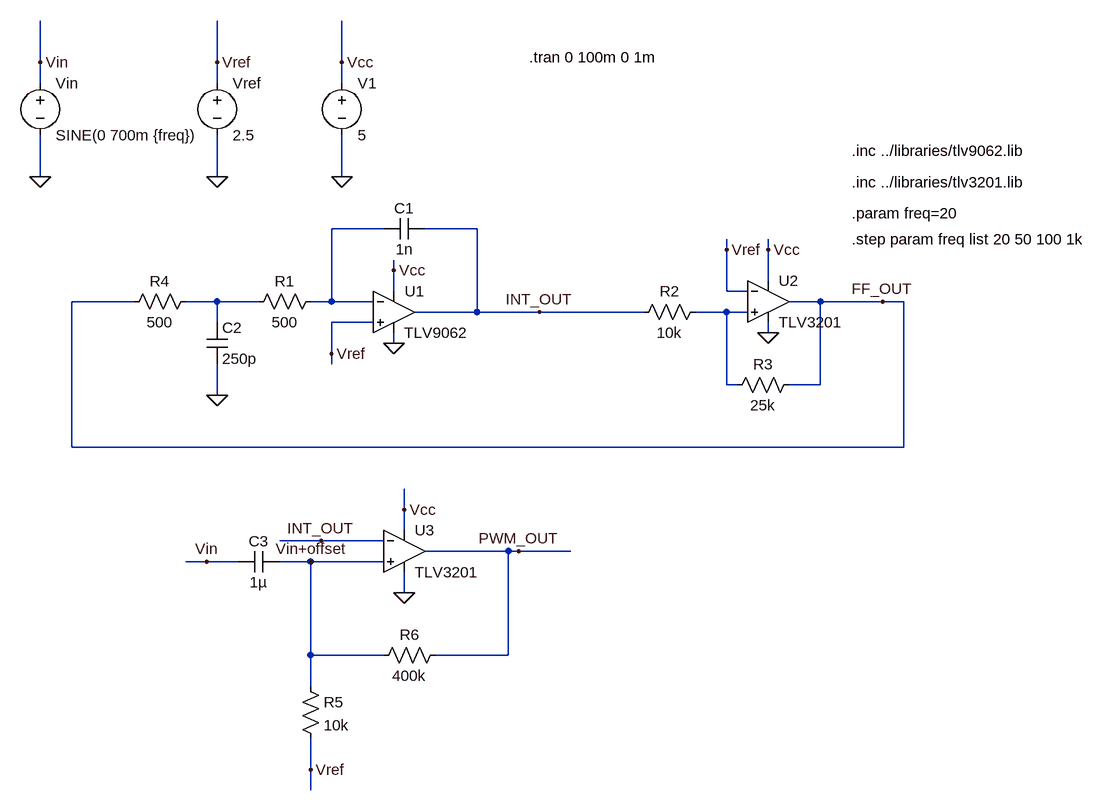
[diagram p0: schematic PWM_modulator.asc]
PWM_modulator.asc, the LTspice schematic file:
Version 4
SHEET 1 1432 980
WIRE -704 -176 -704 -240
WIRE -432 -176 -432 -240
WIRE -240 -176 -240 -240
WIRE -704 -144 -704 -176
WIRE -432 -144 -432 -176
WIRE -240 -144 -240 -176
WIRE -704 0 -704 -64
WIRE -432 0 -432 -64
WIRE -240 0 -240 -64
WIRE -176 80 -256 80
WIRE -32 80 -112 80
WIRE 352 112 352 96
WIRE 416 112 416 96
WIRE -160 144 -160 128
WIRE 416 160 416 112
WIRE -160 176 -160 144
WIRE 352 176 352 112
WIRE 384 176 352 176
WIRE -560 192 -656 192
WIRE -432 192 -480 192
WIRE -368 192 -432 192
WIRE -256 192 -256 80
WIRE -256 192 -288 192
WIRE -192 192 -256 192
WIRE 496 192 448 192
WIRE 592 192 496 192
WIRE 624 192 592 192
WIRE -32 208 -32 80
WIRE -32 208 -128 208
WIRE 64 208 -32 208
WIRE 224 208 64 208
WIRE 352 208 304 208
WIRE 384 208 352 208
WIRE -432 224 -432 192
WIRE -192 224 -256 224
WIRE 416 240 416 224
WIRE -160 256 -160 240
WIRE -256 272 -256 224
WIRE -256 288 -256 272
WIRE 352 320 352 208
WIRE 368 320 352 320
WIRE 496 320 496 192
WIRE 496 320 448 320
WIRE -432 336 -432 288
WIRE -656 416 -656 192
WIRE 624 416 624 192
WIRE 624 416 -656 416
WIRE -144 512 -144 480
WIRE -144 544 -144 512
WIRE -272 560 -336 560
WIRE -176 560 -272 560
WIRE 16 576 -112 576
WIRE 32 576 16 576
WIRE 112 576 32 576
WIRE -448 592 -480 592
WIRE -400 592 -448 592
WIRE -288 592 -336 592
WIRE -176 592 -288 592
WIRE -144 640 -144 608
WIRE -288 736 -288 592
WIRE -176 736 -288 736
WIRE 16 736 16 576
WIRE 16 736 -96 736
WIRE -288 784 -288 736
WIRE -288 912 -288 864
WIRE -288 944 -288 912
FLAG -160 256 0
FLAG 416 240 0
FLAG -432 0 0
FLAG -432 -176 Vref
FLAG -256 272 Vref
FLAG 352 112 Vref
FLAG -240 0 0
FLAG -240 -176 Vcc
FLAG 416 112 Vcc
FLAG -160 144 Vcc
FLAG 592 192 FF_OUT
FLAG 64 208 INT_OUT
FLAG -432 336 0
FLAG -704 0 0
FLAG -144 640 0
FLAG -144 512 Vcc
FLAG -272 560 INT_OUT
FLAG -288 912 Vref
FLAG -448 592 Vin
FLAG 32 576 PWM_OUT
FLAG -704 -176 Vin
FLAG -288 592 Vin+offset
SYMBOL OpAmps\\opamp2 -160 144 R0
WINDOW 0 32 32 Center 2
SYMATTR InstName U1
SYMATTR Value TLV9062
SYMBOL OpAmps\\opamp2 416 128 R0
SYMATTR InstName U2
SYMATTR Value TLV3201
SYMBOL cap -112 64 R90
WINDOW 0 0 32 VBottom 2
WINDOW 3 32 32 VTop 2
SYMATTR InstName C1
SYMATTR Value 1n
SYMBOL res -272 176 R90
WINDOW 0 0 56 VBottom 2
WINDOW 3 32 56 VTop 2
SYMATTR InstName R1
SYMATTR Value 500
SYMBOL voltage -432 -160 R0
WINDOW 123 0 0 Left 0
WINDOW 39 0 0 Left 0
SYMATTR InstName Vref
SYMATTR Value 2.5
SYMBOL res 320 192 R90
WINDOW 0 0 56 VBottom 2
WINDOW 3 32 56 VTop 2
SYMATTR InstName R2
SYMATTR Value 10k
SYMBOL res 464 304 R90
WINDOW 0 0 56 VBottom 2
WINDOW 3 32 56 VTop 2
SYMATTR InstName R3
SYMATTR Value 25k
SYMBOL voltage -240 -160 R0
WINDOW 123 0 0 Left 0
WINDOW 39 0 0 Left 0
SYMATTR InstName V1
SYMATTR Value 5
SYMBOL res -464 176 R90
WINDOW 0 0 56 VBottom 2
WINDOW 3 32 56 VTop 2
SYMATTR InstName R4
SYMATTR Value 500
SYMBOL cap -448 224 R0
SYMATTR InstName C2
SYMATTR Value 250p
SYMBOL voltage -704 -160 R0
WINDOW 123 0 0 Left 0
WINDOW 39 0 0 Left 0
SYMATTR InstName Vin
SYMATTR Value SINE(0 700m {freq})
SYMBOL OpAmps\\opamp2 -144 512 R0
SYMATTR InstName U3
SYMATTR Value TLV3201
SYMBOL cap -336 576 R90
WINDOW 0 0 32 VBottom 2
WINDOW 3 32 32 VTop 2
SYMATTR InstName C3
SYMATTR Value 1µ
SYMBOL res -304 768 R0
SYMATTR InstName R5
SYMATTR Value 10k
SYMBOL res -80 720 R90
WINDOW 0 0 56 VBottom 2
WINDOW 3 32 56 VTop 2
SYMATTR InstName R6
SYMATTR Value 400k
TEXT 544 -40 Left 2 !.inc ../libraries/tlv9062.lib
TEXT 544 8 Left 2 !.inc ../libraries/tlv3201.lib
TEXT 48 -184 Left 2 !.tran 0 100m 0 1m
TEXT 544 56 Left 2 !.param freq=20
TEXT 544 96 Left 2 !.step param freq list 20 50 100 1k

The netlist it stands for:
* PWM_modulator.asc
XU1 Vref N001 Vcc 0 INT_OUT TLV9062  ; pins In+ In- V+ V- OUT
XU2 N003 Vref Vcc 0 FF_OUT TLV3201  ; pins In+ In- V+ V- OUT
C1 INT_OUT N001 1n
R1 N001 N002 500
Vref Vref 0 2.5
R2 N003 INT_OUT 10k
R3 FF_OUT N003 25k
V1 Vcc 0 5
R4 N002 FF_OUT 500
C2 N002 0 250p
Vin Vin 0 SINE(0 700m {freq})
XU3 Vin+offset INT_OUT Vcc 0 PWM_OUT TLV3201  ; pins In+ In- V+ V- OUT
C3 Vin+offset Vin 1µ
R5 Vin+offset Vref 10k
R6 PWM_OUT Vin+offset 400k
.inc ../libraries/tlv9062.lib
.inc ../libraries/tlv3201.lib
.tran 0 100m 0 1m
.param freq=20
.step param freq list 20 50 100 1k
.backanno
.end